# EAGLE design Tayloe Detector v2 (EAGLE 9.1.2)
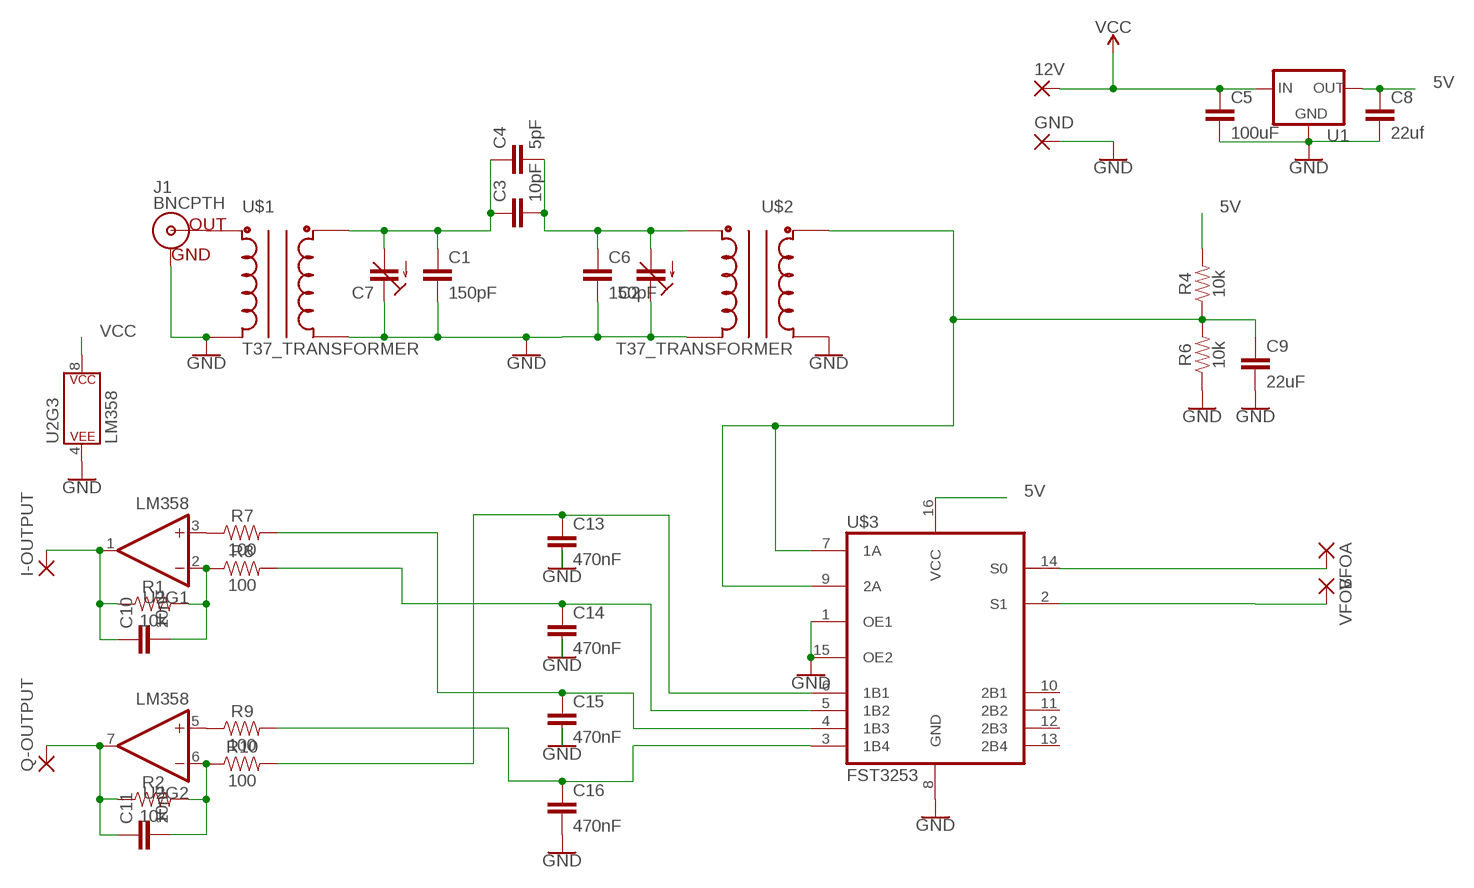
[diagram p0: schematic, sheet 1]

## Parts
12V  3,17/1,1  [3,17/1,1]
C1  150pF  C5/3.5  [C5B3.5]
C2  C-TRIMMTZ03  [CTRIMTZ03]
C3  10pF  C5/3.5  [C5B3.5]
C4  5pF  C5/3.5  [C5B3.5]
C5  100uF  C5/3.5  [C5B3.5]
C6  150pF  C5/3.5  [C5B3.5]
C7  C-TRIMMTZ03  [CTRIMTZ03]
C8  22uf  C5/3.5  [C5B3.5]
C9  22uF  C5/3.5  [C5B3.5]
C10  10nF  C5/3.5  [C5B3.5]
C11  10nF  C5/3.5  [C5B3.5]
C13  470nF  C5/3.5  [C5B3.5]
C14  470nF  C5/3.5  [C5B3.5]
C15  470nF  C5/3.5  [C5B3.5]
C16  470nF  C5/3.5  [C5B3.5]
GND  3,17/1,1  [3,17/1,1]
I-OUTPUT  3,17/1,1  [3,17/1,1]
J1  BNCPTH  [BNC]
Q-OUTPUT  3,17/1,1  [3,17/1,1]
R1  10k  1KOHM-HORIZ-1/4W-1%  [AXIAL-0.3]
R2  10k  1KOHM-HORIZ-1/4W-1%  [AXIAL-0.3]
R4  10k  1KOHM-HORIZ-1/4W-1%  [AXIAL-0.3]
R6  10k  1KOHM-HORIZ-1/4W-1%  [AXIAL-0.3]
R7  100  1KOHM-HORIZ-1/4W-1%  [AXIAL-0.3]
R8  100  1KOHM-HORIZ-1/4W-1%  [AXIAL-0.3]
R9  100  1KOHM-HORIZ-1/4W-1%  [AXIAL-0.3]
R10  100  1KOHM-HORIZ-1/4W-1%  [AXIAL-0.3]
U1  V_REG_78XXTO-92_UNTESTED  [TO-92]
U2  LM358  [DIP08]
U$1  T37_TRANSFORMER  [T37_TRANSFORMER]
U$2  T37_TRANSFORMER  [T37_TRANSFORMER]
U$3  FST3253  [SO16]
VFOA  3,17/1,1  [3,17/1,1]
VFOB  3,17/1,1  [3,17/1,1]

## Nets
5V: C8.1 R4.P$2 U1.1(OUT) U$3.16(VCC)
GND: C1.2 C2.1(E) C5.2 C6.2 C7.1(E) C8.2 C9.2 C13.2 C14.2 C15.2 C16.2 GND.1(P) J1.GND R6.P$1 U1.2(GND) U2.4(P$V-) U$1.C1A U$1.C2A U$2.C1A U$2.C2A U$3.1(OE1) U$3.8(GND) U$3.15(OE2)
N$2: R7.P$1 U2.3(+IN)
N$3: C1.1 C3.1 C4.1 C7.2(A) U$1.C2B
N$4: C2.2(A) C3.2 C4.2 C6.1 U$2.C2B
N$5: C9.1 R4.P$1 R6.P$2 U$2.C1B U$3.7(1A) U$3.9(2A)
N$6: C10.2 R1.P$2 R8.P$1 U2.2(-IN)
N$7: J1.S(OUT) U$1.C1B
N$8: R9.P$1 U2.5(+IN)
N$10: C10.1 I-OUTPUT.1(P) R1.P$1 U2.1(OUT)
N$11: C14.1 R8.P$2 U$3.5(1B2)
N$12: C11.2 R2.P$2 R10.P$1 U2.6(-IN)
N$13: C15.1 R7.P$2 U$3.4(1B3)
N$14: C13.1 R10.P$2 U$3.6(1B1)
N$15: U$3.14(S0) VFOA.1(P)
N$16: C11.1 Q-OUTPUT.1(P) R2.P$1 U2.7(OUT)
N$17: U$3.2(S1) VFOB.1(P)
N$18: C16.1 R9.P$2 U$3.3(1B4)
VCC: 12V.1(P) C5.1 U1.3(IN) U2.8(P$V+)
Unconnected: U$3.10(2B1) U$3.11(2B2) U$3.12(2B3) U$3.13(2B4)

## Library data of the parts
12V GND I-OUTPUT Q-OUTPUT VFOA VFOB = wirepad:3,17/1,1: THROUGH-HOLE PAD
C1 C3-C6 C8-C11 C13-C16 = capacitor-wima:C: CAPACITOR naming: grid - package width
C2 C7 = resistor:C-TRIMM: Trimm capacitor
J1 = SparkFun-Connectors:BNC: BNC Right Angle Connector Mouser Part# 5227161 SparkFun Products: BNC Connector - Right Angle <https://www.sparkfun.com/products/10550>; PROD_ID: LPA-12729; SF_ID: PRT-10550
R1 R2 R4 R6-R10 = SparkFun-Resistors:1KOHM: 1kΩ resistor A resistor is a passive two-terminal electrical component that implements electrical resistance as a circuit element. Resistors act to reduce current flow, and, at the same time, act to lower voltage levels within circuits. - Wikipedia; PROD_ID: RES-12182; VALUE: 1k
U1 = SparkFun-IC-Power:V_REG_78XX: Voltage Regulator Standard 78xx regulator. IGO (Input Ground Output). Spark Fun Electronics SKU : COM-00107
U2 = SparkFun-IC-Amplifiers:LM358: LM358 Jellybean op-amp Datasheet <http://www.sparkfun.com/datasheets/Components/General/LM358.pdf> SparkFun Products Op-Amp (Thru-Hole) - LM358 <https://www.sparkfun.com/products/9456> (COM-09456); PROD_ID: IC-09172
U$1 U$2 = toroid:T37_TRANSFORMER: Transformer wound on a T37 Toroid
U$3 = SparkFun-IC-Comms:FST3253: The Fairchild Switch FST3253 is a dual 4:1 high-speed CMOS TTL-compatible multiplexer/demultiplexer bus switch. The low on resistance of the switch allows inputs to be connected to outputs without adding propagation delay or generating additional ground bounce noise. When OE is LOW, S0 and S1 connect the A Port to the selected B Port output. When OE is HIGH, the switch is OPEN and a high-impedance state exists between the two

## Net classes
0 default: width 0.762 mm, drill 0.762 mm, clearance 0.508 mm

## Board
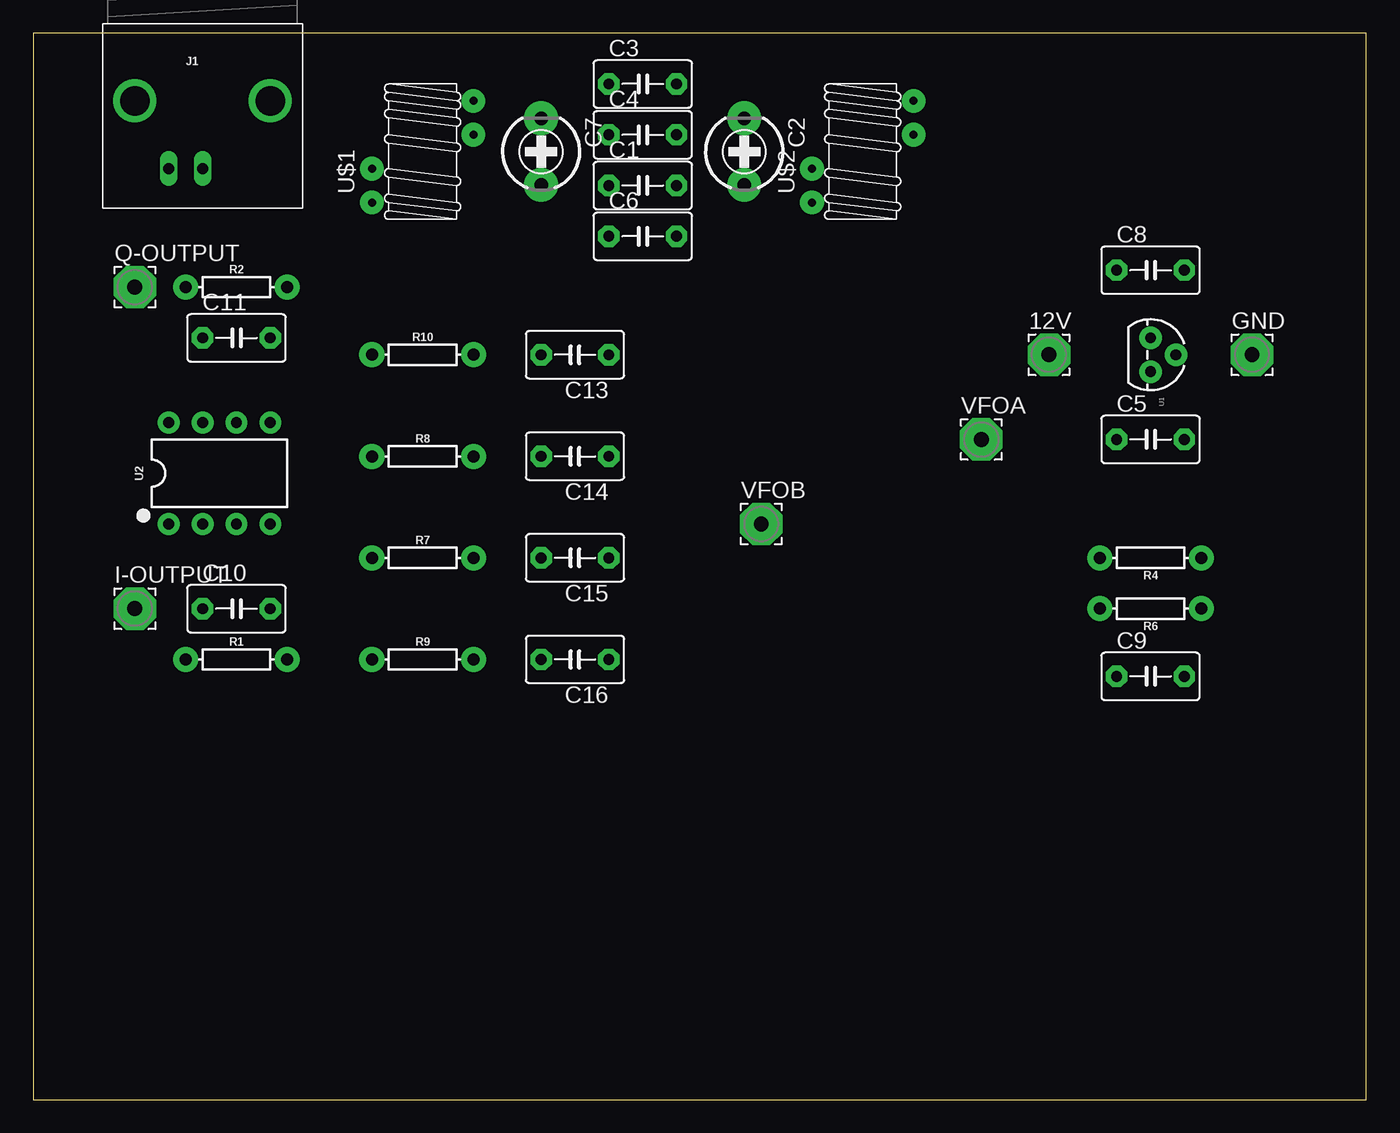
[diagram p1: board, top side]
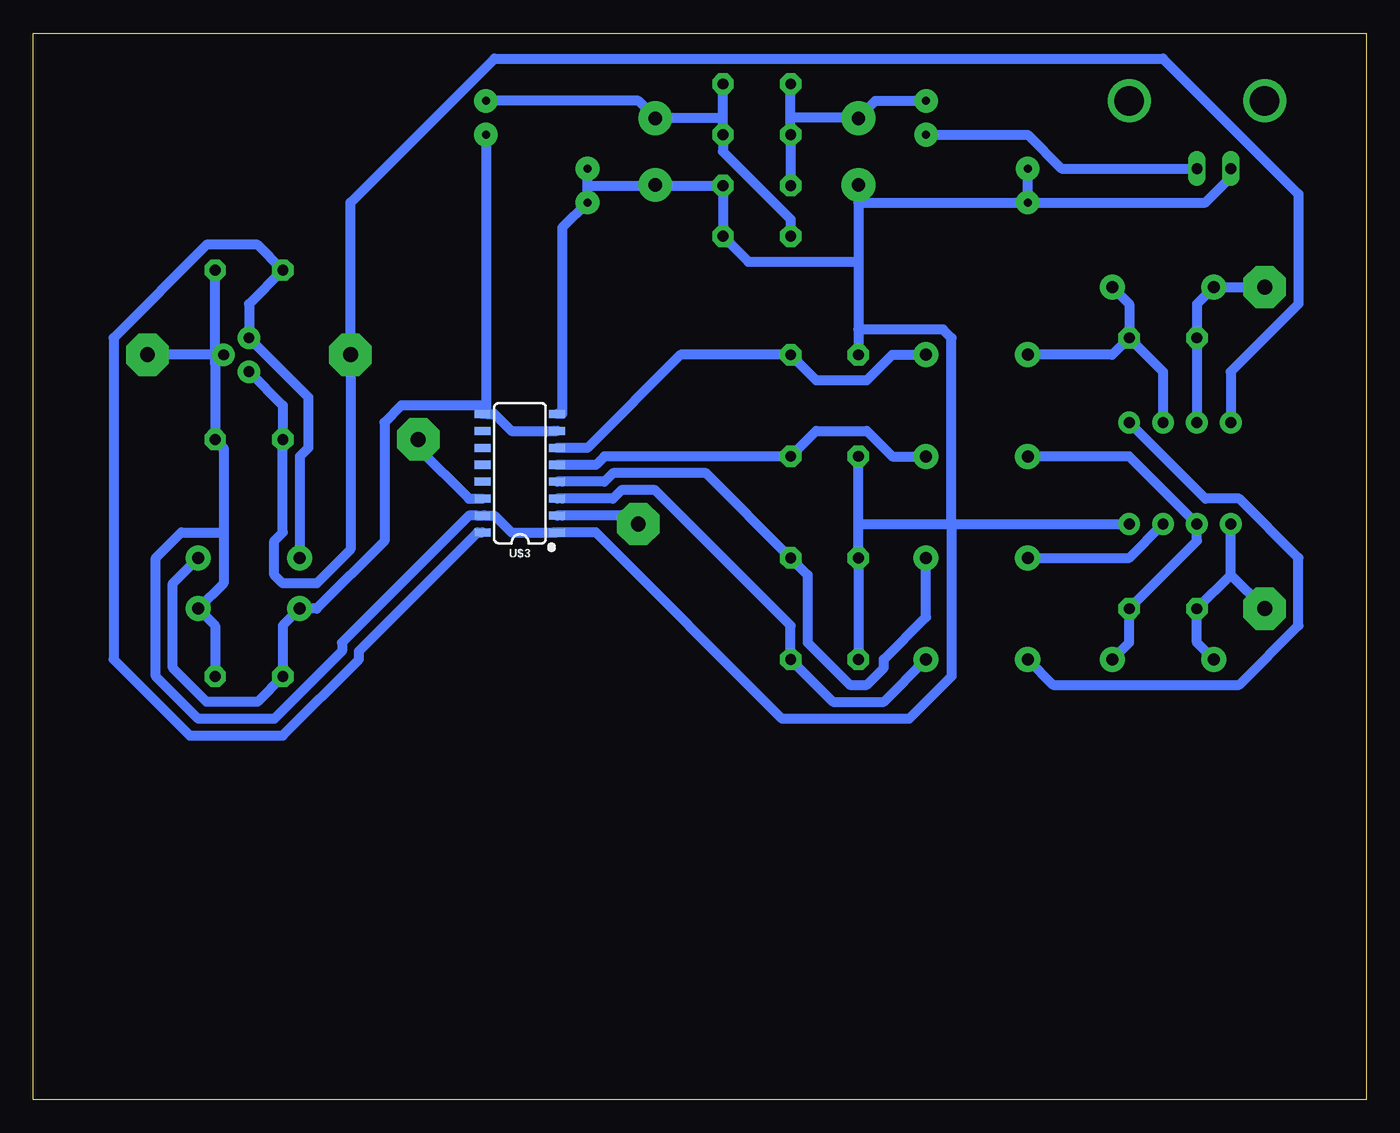
[diagram p2: board, bottom side, seen from below]

Size 100 x 80 mm. Coordinates in mm from the lower left corner, seen from the top.
Outline: 0,0 100,0 100,80 0,80 0,0
Copper layers (1*16): Top 0.035mm / dielectric 1.5mm / Bottom 0.035mm
Design rules "default": minimum track width 6mil, minimum drill 0.35mm, track to track 6mil, track to pad 6mil, pad to pad 6mil, via to via 6mil, smd to smd 6mil, copper to edge 40mil, drill to drill 6mil, minimum pad ring 10mil, minimum via ring 8mil, stop-mask expansion 4mil, vias tented up to drill 0mil, thermal gap 10mil

### Footprints (pad centres in the part's own frame; a part is rotated, then mirrored left to right if it is on the bottom)
3,17/1,1 = drill 1.118 pad 3.175 octagon: 1 0,0
C5B3.5 = drill 0.813 pad 1.6 octagon: 1 -2.54,0; 2 2.54,0
CTRIMTZ03 = drill 1 pad 2.54: 1 0,2.5; 2 0,-2.5
BNC = drill 2.2: 3 -5.08,5.08; 4 5.08,5.08 | drill 0.8 long: GND -2.54,0; S 0,0
AXIAL-0.3 = drill 0.9 pad 1.88: P$1 -3.81,0; P$2 3.81,0
TO-92 = drill 0.813 pad 1.676: 1 -1.27,0; 2 0,1.905; 3 1.27,0
DIP08 = drill 0.813 pad 1.626: 1 -3.81,-3.81; 2 -1.27,-3.81; 3 1.27,-3.81; 4 3.81,-3.81; 5 3.81,3.81; 6 1.27,3.81; 7 -1.27,3.81; 8 -3.81,3.81
T37_TRANSFORMER = drill 0.6 pad 1.778: C1A -3.81,-3.81; C1B 3.81,1.27; C2A -3.81,-1.27; C2B 3.81,3.81
SO16 = smd 0.6 x 1.2: 1 -4.445,-2.8; 2 -3.175,-2.8; 3 -1.905,-2.8; 4 -0.635,-2.8; 5 0.635,-2.8; 6 1.905,-2.8; 7 3.175,-2.8; 8 4.445,-2.8; 9 4.445,2.8; 10 3.175,2.8; 11 1.905,2.8; 12 0.635,2.8; 13 -0.635,2.8; 14 -1.905,2.8; 15 -3.175,2.8; 16 -4.445,2.8

### Placement (x,y rotation side)
12V  76.2,55.88 0 top
C1  45.72,68.58 0 top
C2  53.34,71.12 180 top
C3  45.72,76.2 0 top
C4  45.72,72.39 0 top
C5  83.82,49.53 0 top
C6  45.72,64.77 0 top
C7  38.1,71.12 180 top
C8  83.82,62.23 0 top
C9  83.82,31.75 0 top
C10  15.24,36.83 0 top
C11  15.24,57.15 0 top
C13  40.64,55.88 180 top
C14  40.64,48.26 180 top
C15  40.64,40.64 180 top
C16  40.64,33.02 180 top
GND  91.44,55.88 0 top
I-OUTPUT  7.62,36.83 0 top
J1  12.7,69.85 0 top
Q-OUTPUT  7.62,60.96 0 top
R1  15.24,33.02 0 top
R2  15.24,60.96 0 top
R4  83.82,40.64 180 top
R6  83.82,36.83 180 top
R7  29.21,40.64 0 top
R8  29.21,48.26 0 top
R9  29.21,33.02 0 top
R10  29.21,55.88 0 top
U1  83.82,55.88 270 top
U2  13.97,46.99 0 top
U$1  29.21,71.12 0 top
U$2  62.23,71.12 0 top
U$3  63.5,46.99 90 bottom
VFOA  71.12,49.53 0 top
VFOB  54.61,43.18 0 top

### Tracks (layer width: path | path; a pad name or v marks a point on that pad's centre or on a via)
5V
  Bottom 0.762: U$3.16 66.67,42.55 75.56,33.66 75.56,33.02 81.28,27.3 88.27,27.3 93.98,33.02 93.98,57.15 87,64.14 83.19,64.14 C8.1 83.82,59.69 U1.1 79.38,52.7 79.38,48.9 80.01,48.26 R4.P$2
GND
  Bottom 0.762: J1.GND 10.16,69.22 12.06,67.31 U$1.C1A | U$1.C1A U$1.C2A | 38.1,67.31 38.1,68.58 C7.1 | 38.1,67.31 38.1,62.87 | 38.1,62.87 38.1,57.78 | 38.1,57.78 C13.2 | 53.34,68.58 C1.2 C6.2 46.35,62.87 38.1,62.87 | 53.34,68.58 C2.1 53.34,68.58 | U$3.8 60.33,51.44 60.33,65.41 U$2.C1A 58.42,68.58 | 58.42,68.58 U$2.C2A | 58.42,68.58 53.34,68.58 | 38.1,67.31 U$1.C1A | C9.2 86.36,35.56 R6.P$1 85.72,38.73 85.72,42.55 | 86.36,55.24 C5.2 85.72,48.9 85.72,42.55 | 86.36,55.24 U1.2 86.36,55.88 | 86.36,55.24 86.36,55.88 | 86.36,55.88 C8.2 | 86.36,55.88 GND.1 | C16.2 C15.2 38.1,43.18 | 38.1,43.18 C14.2 | 38.1,43.18 31.11,43.18 | 31.11,43.18 U2.4 | 31.11,43.18 31.11,31.75 34.29,28.57 43.81,28.57 57.78,42.55 60.33,42.55 U$3.1 60.96,42.55 64.14,42.55 65.41,43.81 66.04,43.81 U$3.15 66.67,43.81 67.31,43.81 76.83,34.29 76.83,33.66 81.92,28.57 87.63,28.57 90.81,31.75 90.81,40.64 88.9,42.55 85.72,42.55 | 38.1,57.78 31.75,57.78 31.11,57.15 31.11,43.18
N$2
  Bottom 0.762: U2.3 17.78,40.64 R7.P$1
N$3
  Bottom 0.762: C1.1 C4.1 43.18,73.66 | 43.18,73.66 C3.1 | U$1.C2B 36.83,74.93 38.1,73.66 | 38.1,73.66 C7.2 38.1,73.66 | 38.1,73.66 43.18,73.66
N$4
  Bottom 0.762: C6.1 43.18,66.04 48.26,71.12 C4.2 48.26,73.66 | 48.26,73.66 C3.2 | U$2.C2B 54.61,74.93 53.34,73.66 | 53.34,73.66 C2.2 53.34,73.66 | 53.34,73.66 48.26,73.66
N$5
  Bottom 0.762: R4.P$1 89.53,38.73 89.53,32.38 87,29.84 83.19,29.84 C9.1 81.28,35.56 R6.P$2 78.74,36.83 73.66,41.91 73.66,50.8 72.39,52.07 66.04,52.07 | 66.04,51.44 65.41,51.44 64.14,50.16 60.96,50.16 U$3.7 | 66.04,51.44 U$3.9 66.04,51.44 | U$2.C1B 66.04,52.07 | 66.04,52.07 66.04,51.44
N$6
  Bottom 0.762: R1.P$2 17.78,34.29 C10.2 12.7,41.91 U2.2 17.78,48.26 R8.P$1
N$7
  Bottom 0.762: J1.S 22.86,69.85 25.4,72.39 U$1.C1B
N$8
  Bottom 0.762: U2.5 12.06,45.09 9.53,45.09 5.08,40.64 5.08,35.56 9.53,31.11 23.5,31.11 R9.P$1
N$10
  Bottom 0.762: R1.P$1 12.7,34.29 C10.1 10.16,39.37 | 10.16,39.37 U2.1 | I-OUTPUT.1 10.16,39.37
N$11
  Bottom 0.762: U$3.5 60.33,47.62 57.78,47.62 57.15,48.26 C14.1 41.27,50.16 37.47,50.16 35.56,48.26 R8.P$2
N$12
  Bottom 0.762: C11.2 17.78,59.69 R2.P$2 | U2.6 15.24,54.61 C11.2 | R10.P$1 19.05,55.88 C11.2
N$13
  Bottom 0.762: U$3.4 60.33,46.35 57.15,46.35 56.52,46.99 49.53,46.99 C15.1 41.91,39.37 41.91,34.29 38.73,31.11 37.47,31.11 36.2,32.38 36.2,33.02 33.02,36.2 R7.P$2
N$14
  Bottom 0.762: U$3.6 60.33,48.9 58.42,48.9 51.44,55.88 C13.1 41.27,53.98 37.47,53.98 35.56,55.88 R10.P$2
N$15
  Bottom 0.762: VFOA.1 71.12,48.9 67.31,45.09 66.67,45.09 U$3.14
N$16
  Bottom 0.762: U2.7 C11.1 12.7,59.69 R2.P$1 Q-OUTPUT.1
N$17
  Bottom 0.762: VFOB.1 55.24,43.81 60.33,43.81 U$3.2
N$18
  Bottom 0.762: U$3.3 60.33,45.09 56.52,45.09 55.88,45.72 53.34,45.72 43.18,35.56 C16.1 40.01,29.84 36.2,29.84 R9.P$2
VCC
  Bottom 0.762: U1.3 81.28,52.07 C5.1 81.28,42.55 81.92,41.91 81.92,39.37 81.28,38.73 78.74,38.73 76.2,41.27 12V.1 76.2,67.31 65.41,78.11 15.24,78.11 5.08,67.94 5.08,59.69 10.16,54.61 U2.8